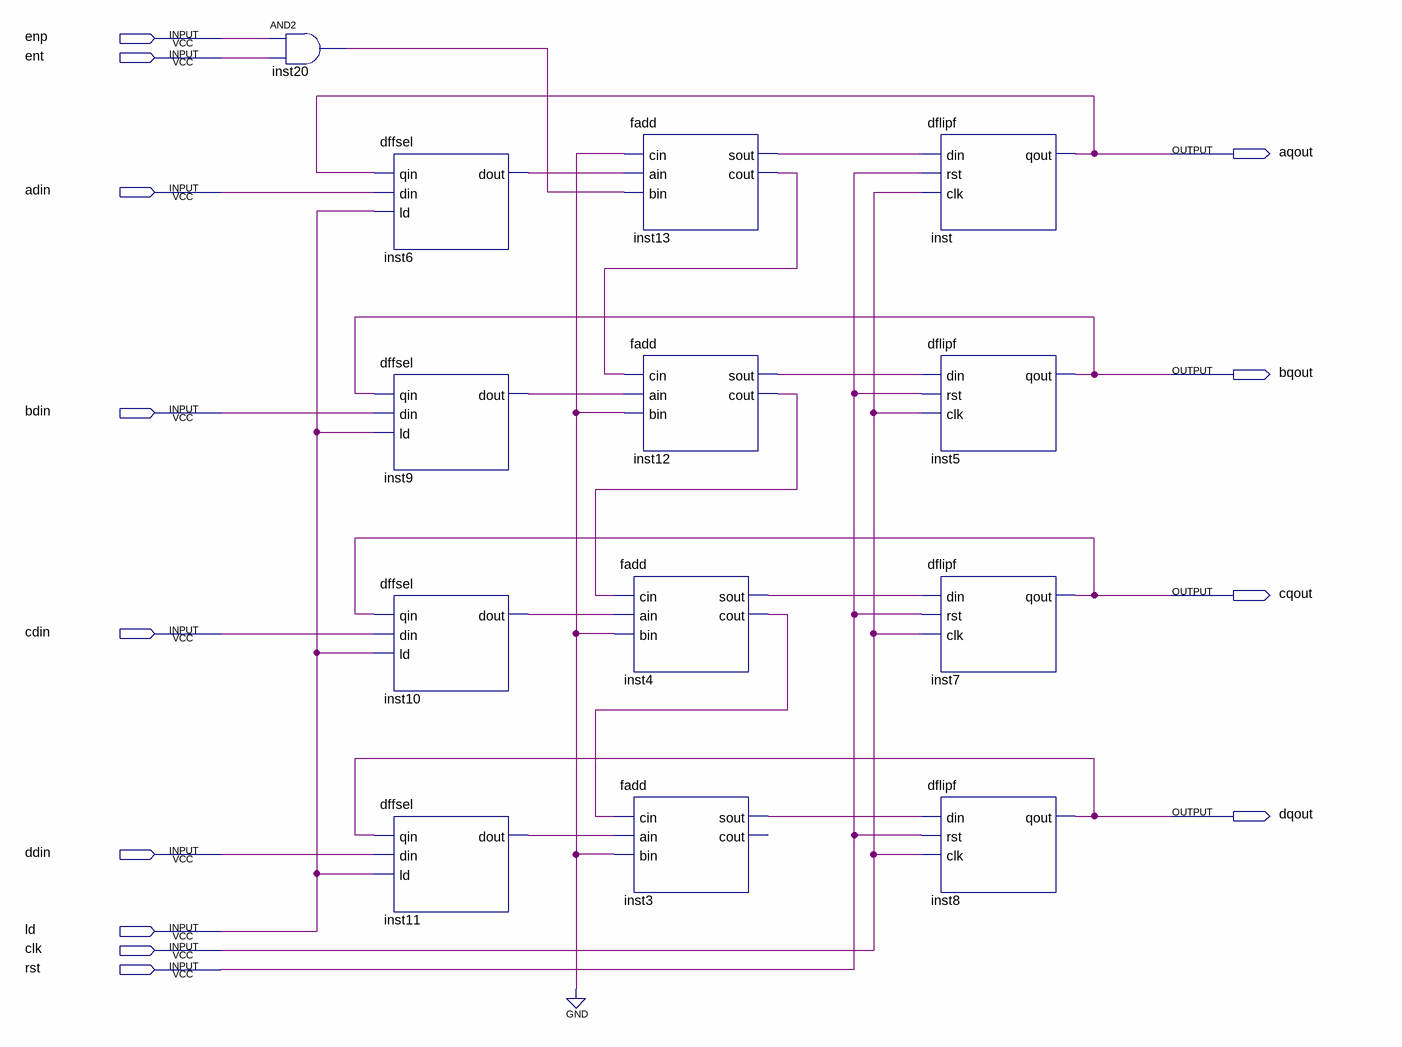
[diagram p0: schematic sheet]
// Quartus schematic hc161.bdf as structural Verilog: 13 symbols, 13 pins
module hc161 (
  input  enp,
  input  ent,
  input  adin,
  input  bdin,
  input  cdin,
  input  ddin,
  input  ld,
  input  clk,
  input  rst,
  output aqout,
  output bqout,
  output cqout,
  output dqout
);

  wire inst3_sout, inst4_cout, inst4_sout, inst6_dout, inst9_dout, inst10_dout, inst11_dout, inst12_cout,
       inst12_sout, inst13_cout, inst13_sout, inst20_out;

  and inst20 (inst20_out, enp, ent);
  dffsel inst6 (.qin(aqout), .din(adin), .ld(ld), .dout(inst6_dout));
  dffsel inst9 (.qin(bqout), .din(bdin), .ld(ld), .dout(inst9_dout));
  dffsel inst10 (.qin(cqout), .din(cdin), .ld(ld), .dout(inst10_dout));
  dffsel inst11 (.qin(dqout), .din(ddin), .ld(ld), .dout(inst11_dout));
  fadd inst13 (.cin(1'b0), .ain(inst6_dout), .bin(inst20_out), .sout(inst13_sout), .cout(inst13_cout));
  fadd inst12 (.cin(inst13_cout), .ain(inst9_dout), .bin(1'b0), .sout(inst12_sout), .cout(inst12_cout));
  fadd inst4 (.cin(inst12_cout), .ain(inst10_dout), .bin(1'b0), .sout(inst4_sout), .cout(inst4_cout));
  fadd inst3 (.cin(inst4_cout), .ain(inst11_dout), .bin(1'b0), .sout(inst3_sout));  // open: cout
  dflipf inst (.din(inst13_sout), .rst(rst), .clk(clk), .qout(aqout));
  dflipf inst5 (.din(inst12_sout), .rst(rst), .clk(clk), .qout(bqout));
  dflipf inst7 (.din(inst4_sout), .rst(rst), .clk(clk), .qout(cqout));
  dflipf inst8 (.din(inst3_sout), .rst(rst), .clk(clk), .qout(dqout));
endmodule
